# Altium schematic sheet Connectors.SchDoc: TRW-TFC
size D; SheetNumber: 1; SheetTotal: 2
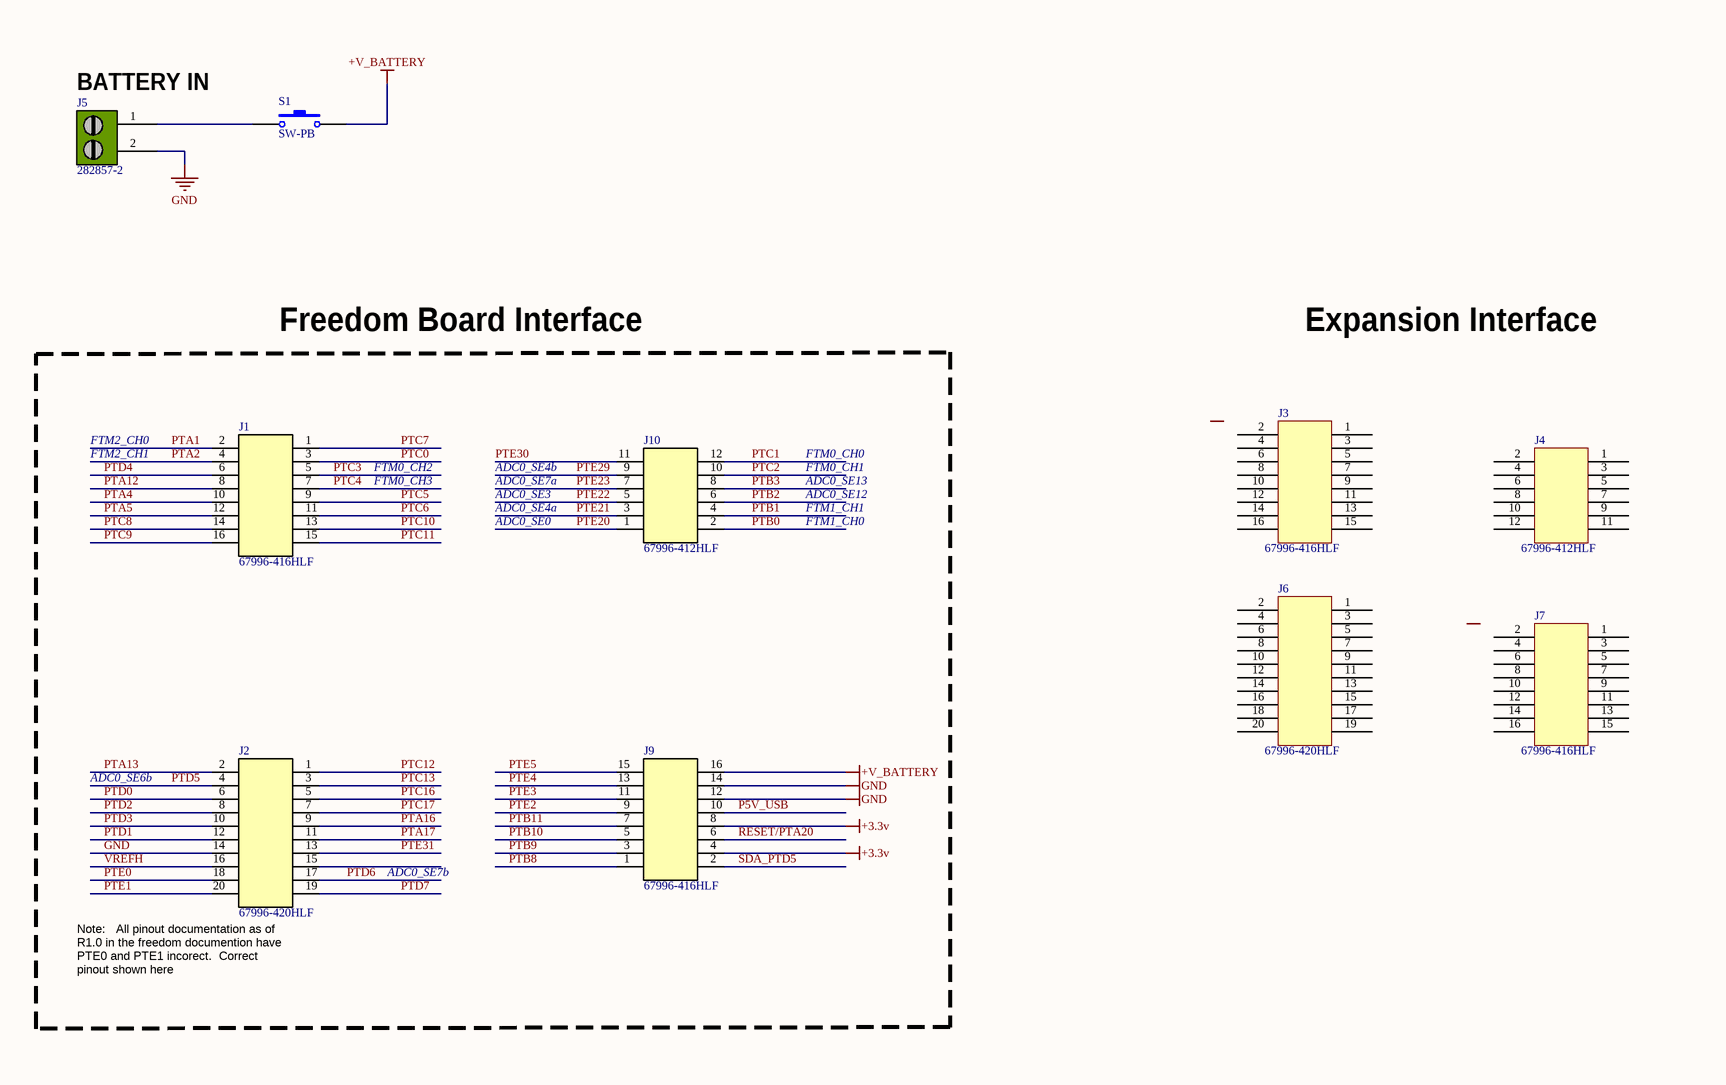
[diagram p0: Connectors.SchDoc, top left]
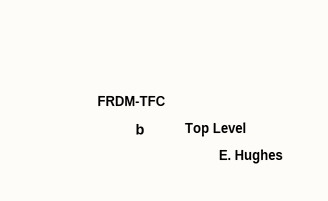
[diagram p1: Connectors.SchDoc, bottom right]

## Parts
J1  67996-416HLF  [67996-416HLF]
J2  67996-420HLF  [67996-420HLF]
J3  67996-416HLF  [67996-416HLF]
J4  67996-412HLF  [67996-412HLF]
J5  282857-2  [282857-2]
J6  67996-420HLF  [67996-420HLF]
J7  67996-416HLF  [67996-416HLF]
J9  67996-416HLF  [67996-416HLF]
J10  67996-412HLF  [67996-412HLF]
S1  SW-PB  [SPST-2]

## Blocks framed on the sheet
Freedom Board Interface: J1 J2 J9 J10

## Nets
+3.3v: J9.4 J9.8
+V_BATTERY: J9.16 S1.2
GND: J2.14 J5.2 J9.12 J9.14
P5V_USB: J9.10
PTA1: J1.2
PTA2: J1.4
PTA4: J1.10
PTA5: J1.12
PTA12: J1.8
PTA13: J2.2
PTA16: J2.9
PTA17: J2.11
PTB0: J10.2
PTB1: J10.4
PTB2: J10.6
PTB3: J10.8
PTB8: J9.1
PTB9: J9.3
PTB10: J9.5
PTB11: J9.7
PTC0: J1.3
PTC1: J10.12
PTC2: J10.10
PTC3: J1.5
PTC4: J1.7
PTC5: J1.9
PTC6: J1.11
PTC7: J1.1
PTC8: J1.14
PTC9: J1.16
PTC10: J1.13
PTC11: J1.15
PTC12: J2.1
PTC13: J2.3
PTC16: J2.5
PTC17: J2.7
PTD0: J2.6
PTD1: J2.12
PTD2: J2.8
PTD3: J2.10
PTD4: J1.6
PTD5: J2.4
PTD6: J2.17
PTD7: J2.19
PTE0: J2.18
PTE1: J2.20
PTE2: J9.9
PTE3: J9.11
PTE4: J9.13
PTE5: J9.15
PTE20: J10.1
PTE21: J10.3
PTE22: J10.5
PTE23: J10.7
PTE29: J10.9
PTE30: J10.11
PTE31: J2.13
RESET/PTA20: J9.6
SDA_PTD5: J9.2
VREFH: J2.16
NetJ5_1: J5.1 S1.1

Not connected (* = marked no-connect by the designer): J2 15; J3 1 2 3 4 5 6 7 8 9 10 11 12 13 14 15 16; J4 1 2 3 4 5 6 7 8 9 10 11 12; J6 1 2 3 4 5 6 7 8 9 10 11 12 13 14 15 16 17 18 19 20; J7 1 2 3 4 5 6 7 8 9 10 11 12 13 14 15 16

## Notes on the sheet
- (near J5) BATTERY IN
- Expansion Interface
- FTM2_CH0
- FTM2_CH1
- FTM0_CH2
- FTM0_CH3
- ADC0_SE4b
- ADC0_SE3
- ADC0_SE7a
- FTM0_CH0
- FTM0_CH1
- ADC0_SE12
- ADC0_SE13
- ADC0_SE0
- ADC0_SE4a
- FTM1_CH0
- FTM1_CH1
- ADC0_SE6b
- ADC0_SE7b
- (near J2) Note:   All pinout documentation as of R1.0 in the freedom documention have PTE0 and PTE1 incorect.  Correct pinout shown here
- FRDM-TFC
- b
- Top Level
- E. Hughes
- -1
- 2
- Wavenumber
- Technologies
- pl
- Rev:
- Sheet
- of

## Library data of the parts
J1 J9 = 67996-416HLF: CONN HEADER 16POS .100 STR TIN; Manufacturer: FCI; Connector Type: Header, Unshrouded; Number of Positions: 16; Number of Positions Loaded: All; Pitch: 0.100" (2.54mm); Manufacturer Part Number: 67996-416HLF; RoHS: RoHS Compliant; Category: Connectors, Interconnects; Contact Type: Male Pin; Number of Rows: 2; Row Spacing: 0.100" (2.54mm); Contact Mating Length: 0.230" (5.84mm); Mounting Type: Through Hole; Termination: Solder; Fastening Type: -; Features: -; Contact Finish: Tin; Contact Finish Thickness: 100µin (2.54µm); Color: Black; Packaging: Bulk; ComponentLink1URL: http://portal.fciconnect.com/Comergent//fci/drawing/67996.pdf; ComponentLink1Description: http://portal.fciconnect.com/Comergent//fci/drawing/67996.pdf; Value: 67996-416HLF; Supplier 1: Digi-Key; Supplier Part Number 1: 609-3220-ND; Stock 1: 1589; Pricing 1: 1=0.56, 10=0.521, 25=0.4684, 50=0.4164, 100=0.3991, 250=0.36436, 500=0.347, 1000=0.28628, 2500=0.26025 (USD)
J2 = 67996-420HLF: CONN HEADER 20POS .100 STR TIN; Manufacturer: FCI; Connector Type: Header, Unshrouded; Number of Positions: 20; Number of Positions Loaded: All; Pitch: 0.100" (2.54mm); Supplier 1: Digi-Key; Supplier Part Number 1: 609-3221-ND; Manufacturer Part Number: 67996-420HLF; RoHS: RoHS Compliant; Category: Connectors, Interconnects; Stock 1: 596; Pricing 1: 1=0.66, 10=0.619, 25=0.5572, 50=0.4952, 100=0.4745, 250=0.43324, 500=0.4126, 1000=0.3404, 2500=0.30945 (USD); Contact Type: Male Pin; Number of Rows: 2; Row Spacing: 0.100" (2.54mm); Contact Mating Length: 0.230" (5.84mm); Mounting Type: Through Hole; Termination: Solder; Fastening Type: -; Features: -; Contact Finish: Tin; Contact Finish Thickness: 100µin (2.54µm); Color: Black; Packaging: Bulk; ComponentLink1URL: http://portal.fciconnect.com/Comergent//fci/drawing/67996.pdf; ComponentLink1Description: http://portal.fciconnect.com/Comergent//fci/drawing/67996.pdf
J3 J7 = 67996-416HLF: CONN HEADER 16POS .100 STR TIN; Supplier 1: Octopart; Supplier Part Number 1: Mouser - 649-67996-416HLF
J4 = 67996-412HLF: CONN HEADER 12POS .100 STR TIN; Supplier 1: Octopart; Supplier Part Number 1: Mouser - 649-67996-412HLF
J5 = 282857-2: TERM BLOCK 2POS SIDE ENT 5.08MM; Manufacturer: TE Connectivity; Number of Levels: 1; Positions Per Level: 2; Pitch: 0.200" (5.08mm); Mating Orientation: Horizontal with Board; Current: 24A; Voltage: 300V; Wire Gauge: 12-30 AWG; Wire Termination: Screw - Rising Cage Clamp; Clamp Material - Plating: Brass - Nickel Plated; Torque - Screw: 0.79 Nm (7.0 Lb-In); Screw Thread: M3; Supplier 1: Digi-Key; Supplier Part Number 1: A98359-ND; Manufacturer Part Number: 282857-2; RoHS: RoHS Compliant; Category: Connectors, Interconnects; Stock 1: 1811; Pricing 1: 1=1.19, 10=1.046, 25=0.984, 50=0.9432, 100=0.9021, 250=0.82012, 500=0.7381, 1000=0.65608, 2500=0.59457 (USD); Mounting Type: Through Hole; Features: Interlocking (Side); Color: Green; Packaging: Bulk; Operating Temperature: -; Housing Material: Polyamide (PA66), Nylon 6/6; Contact Material - Plating: Brass - Tin Plated; Screw Material - Plating: Brass - Nickel Plated; ComponentLink1URL: http://documents.tycoelectronics.com/commerce/DocumentDelivery/DDEController?Action=srchrtrv&DocNm=282857&DocType=CD&DocLang=EN; ComponentLink1Description: http://documents.tycoelectronics.com/commerce/DocumentDelivery/DDEController?Action=srchrtrv&DocNm=282857&DocType=CD&DocLang=EN; Value: 282857-2
J6 = 67996-420HLF: CONN HEADER 20POS .100 STR TIN; Supplier 1: Octopart; Supplier Part Number 1: Mouser - 649-67996-420HLF
J10 = 67996-412HLF: CONN HEADER 12POS .100 STR TIN; Manufacturer: FCI; Connector Type: Header, Unshrouded; Number of Positions: 12; Number of Positions Loaded: All; Pitch: 0.100" (2.54mm); Supplier 1: Digi-Key; Supplier Part Number 1: 609-3219-ND; Manufacturer Part Number: 67996-412HLF; RoHS: RoHS Compliant; Category: Connectors, Interconnects; Stock 1: 1044; Pricing 1: 1=0.4, 10=0.379, 25=0.3248, 50=0.276, 100=0.2651, 250=0.23804, 500=0.22722, 1000=0.18935, 2500=0.17312 (USD); Contact Type: Male Pin; Number of Rows: 2; Row Spacing: 0.100" (2.54mm); Contact Mating Length: 0.230" (5.84mm); Mounting Type: Through Hole; Termination: Solder; Fastening Type: -; Features: -; Contact Finish: Tin; Contact Finish Thickness: 100µin (2.54µm); Color: Black; Packaging: Bulk; ComponentLink1URL: http://portal.fciconnect.com/Comergent//fci/drawing/67996.pdf; ComponentLink1Description: http://portal.fciconnect.com/Comergent//fci/drawing/67996.pdf; Value: 67996-412HLF
S1 = SW-PB: Switch; Published: 24-Mar-1999; LatestRevisionDate: 17-Jul-2002; LatestRevisionNote: Re-released for DXP Platform.; PackageReference: SPST-2; Publisher: Altium Limited; PackageDescription: Switch; 2 Leads